# Altium project HIL_RIG_Hardware.PrjPcb (part 5 of 11)

## Sheet  PWM_Output.SchDoc
size A3; SheetNumber: 13; SheetTotal: 29
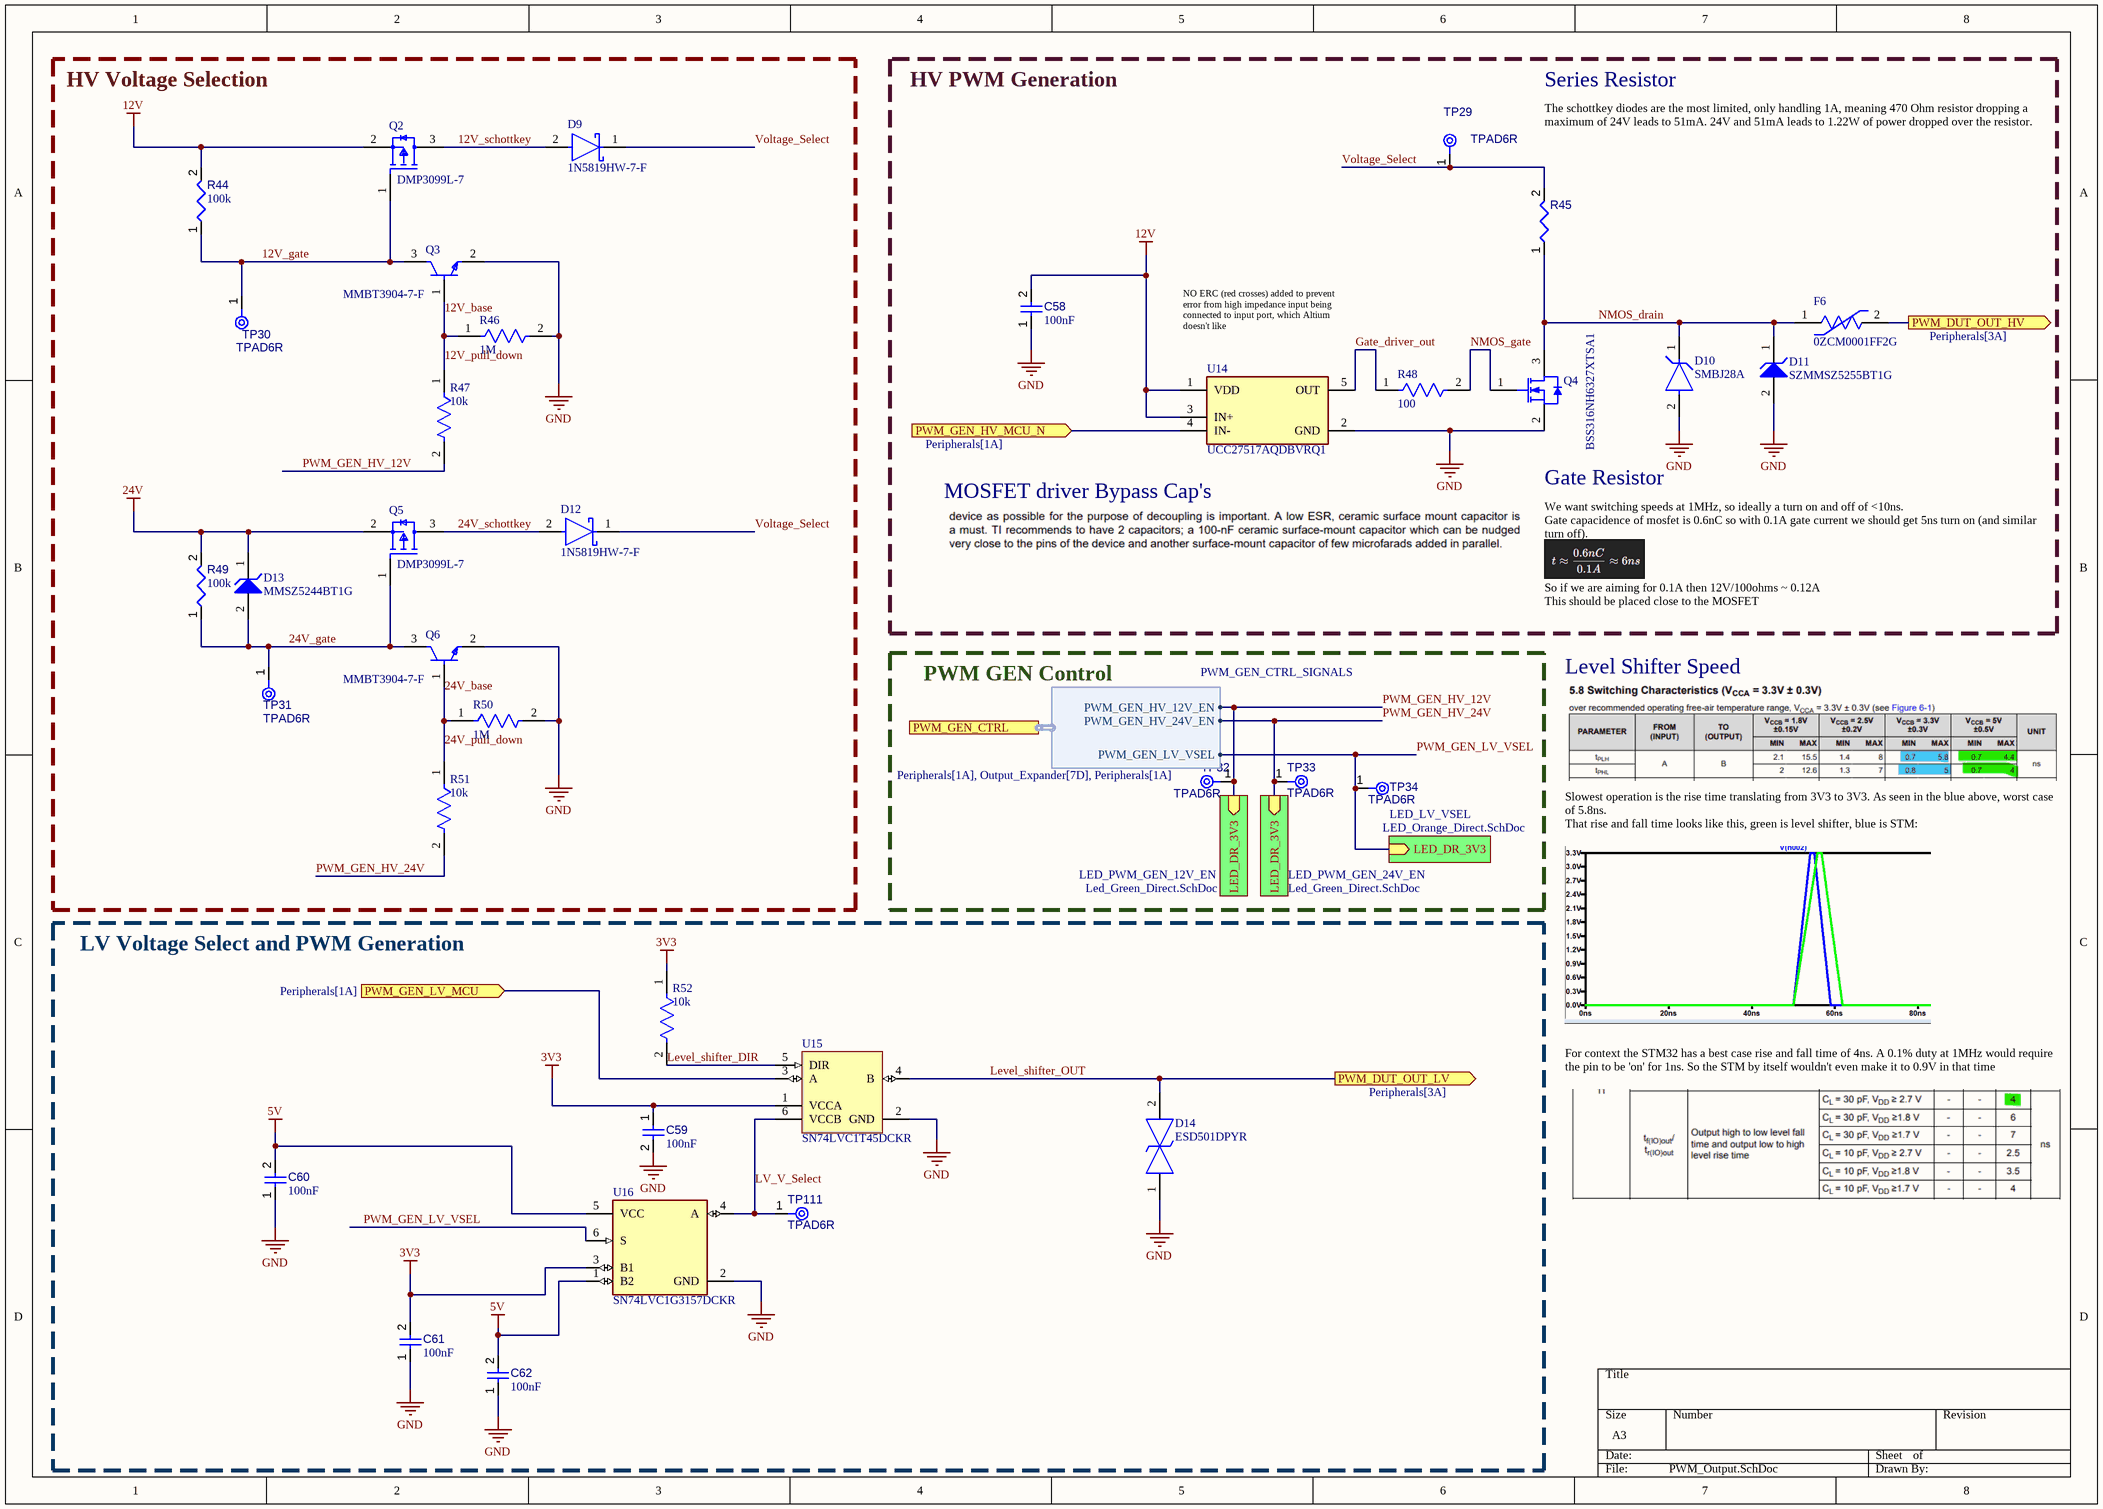
[diagram p9:  PWM_Output.SchDoc]

### Parts
C58  value 100nF  [CAPC1608X90X40NL10T20]  (hidden comment: Capacitor 100 nF +/-10% 50 V 0603)
C59  value 100nF  [CAPC1608X90X40NL10T20]  (hidden comment: Capacitor 100 nF +/-10% 50 V 0603)
C60  value 100nF  [CAPC1608X90X40NL10T20]  (hidden comment: Capacitor 100 nF +/-10% 50 V 0603)
C61  value 100nF  [CAPC1608X90X40NL10T20]  (hidden comment: Capacitor 100 nF +/-10% 50 V 0603)
C62  value 100nF  [CAPC1608X90X40NL10T20]  (hidden comment: Capacitor 100 nF +/-10% 50 V 0603)
D9  1N5819HW-7-F  [FP-SOD123-IPC_C]
D10  SMBJ28A  [FP-SMBJ-MFG]
D11  SZMMSZ5255BT1G  [ONSC-SOD-123-2-425-04_V]
D12  1N5819HW-7-F  [FP-SOD123-IPC_C]
D13  MMSZ5244BT1G  [ONSC-SOD-123-2-425-04_V]
D14  ESD501DPYR  [ESD501DPYR]
F6  0ZCM0001FF2G  [FP-0ZCM0001FF2G-MFG]
Q2  DMP3099L-7  [FP-SOT23-IPC_A]
Q3  MMBT3904-7-F  [FP-SOT23-IPC_A]
Q4  BSS316NH6327XTSA1  [INF-PG-SOT23_L]
Q5  DMP3099L-7  [FP-SOT23-IPC_A]
Q6  MMBT3904-7-F  [FP-SOT23-IPC_A]
R44  value 100k  [FP-AC0603-IPC_C]  (hidden comment: AC0603FR-07100KL)
R45  HOCR2512-2W-470R-5%  [RESC6432X95N]  (value not drawn)
R46  value 1M  [FP-CRGP0603-IPC_C]  (hidden comment: CRGP0603F1M0)
R47  value 10k  [FP-RT0603-IPC_C]  (hidden comment: RT0603BRD0710KL)
R48  value 100  [FP-CRGP2512-IPC_A]  (hidden comment: CRGP2512F100R)
R49  value 100k  [FP-AC0603-IPC_C]  (hidden comment: AC0603FR-07100KL)
R50  value 1M  [FP-CRGP0603-IPC_C]  (hidden comment: CRGP0603F1M0)
R51  value 10k  [FP-RT0603-IPC_C]  (hidden comment: RT0603BRD0710KL)
R52  value 10k  [FP-RT0603-IPC_C]  (hidden comment: RT0603BRD0710KL)
TP29  TPAD6R  [TP06R]  (no BOM)
TP30  TPAD6R  [TP06R]  (no BOM)
TP31  TPAD6R  [TP06R]  (no BOM)
TP32  TPAD6R  [TP06R]  (no BOM)
TP33  TPAD6R  [TP06R]  (no BOM)
TP34  TPAD6R  [TP06R]  (no BOM)
TP111  TPAD6R  [TP06R]  (no BOM)
U14  UCC27517AQDBVRQ1  [FP-DBV0005A-IPC_B]
U15  SN74LVC1T45DCKR  [DCK0006A_M]
U16  SN74LVC1G3157DCKR  [FP-DCK0006A-MFG]

### Blocks framed on the sheet
HV Voltage Selection: D9 D12 D13 Q2 Q3 Q5 Q6 R44 R46 R47 R49-R51 TP30 TP31
PWM GEN Control: TP32-TP34
LV Voltage Select and PWM Generation: C59-C62 D14 R52 TP111 U15 U16

### Sub-sheets
LED_LV_VSEL = LED_Orange_Direct.SchDoc (file not in this document): LED_DR_3V3 (in)
LED_PWM_GEN_12V_EN = Led_Green_Direct.SchDoc (file not in this document): LED_DR_3V3 (in)
LED_PWM_GEN_24V_EN = Led_Green_Direct.SchDoc (file not in this document): LED_DR_3V3 (in)

### Ports
PWM_DUT_OUT_HV (out, see Peripherals[3A]), PWM_DUT_OUT_LV (out, see Peripherals[3A]), PWM_GEN_CTRL (harness PWM_GEN_CTRL_SIGNALS, see Peripherals[1A], Output_Expander[7D], Peripherals[1A]), PWM_GEN_HV_MCU_N (in, see Peripherals[1A]), PWM_GEN_LV_MCU (in, see Peripherals[1A])

### Harnesses
PWM_GEN_CTRL_SIGNALS: PWM_GEN_HV_12V_EN, PWM_GEN_HV_24V_EN, PWM_GEN_LV_VSEL

### Nets
3V3: C59.1 C61.2 R52.1 U15.1(VCCA) U16.3(B1)
5V: C60.2 C62.2 U16.1(B2) U16.5(VCC)
12V: C58.2 Q2.2(S) R44.2 U14.1(VDD) U14.3(IN+)
24V: D13.1(K) Q5.2(S) R49.2
GND: C58.1 C59.2 C60.1 C61.1 C62.1 D10.2(A) D11.2(A) D14.1 Q3.2(E) Q4.2(SOURCE) Q6.2(E) R46.2 R50.2 U14.2(GND) U15.2(GND) U16.2(GND)
12V_base: Q3.1(B) R46.1 R47.1  [also labelled 12V_pull_down]
12V_gate: Q2.1(G) Q3.3(C) R44.1 TP30.1(TP)
12V_schottkey: D9.2(A) Q2.3(D)
24V_base: Q6.1(B) R50.1 R51.1  [also labelled 24V_pull_down]
24V_gate: D13.2(A) Q5.1(G) Q6.3(C) R49.1 TP31.1(TP)
24V_schottkey: D12.2(A) Q5.3(D)
Gate_driver_out: R48.1 U14.5(OUT)
Level_shifter_DIR: R52.2 U15.5(DIR)
Level_shifter_OUT: D14.2 U15.4(B) ; port PWM_DUT_OUT_LV
LV_V_Select: TP111.1(TP) U15.6(VCCB) U16.4(A)
NMOS_drain: D10.1(C) D11.1(K) F6.1 Q4.3(DRAIN) R45.1
NMOS_gate: Q4.1(GATE) R48.2
PWM_GEN_HV_12V: R47.2 TP32.1(TP) ; sheet LED_PWM_GEN_12V_EN/LED_DR_3V3, port PWM_GEN_CTRL.PWM_GEN_HV_12V_EN
PWM_GEN_HV_24V: R51.2 TP33.1(TP) ; sheet LED_PWM_GEN_24V_EN/LED_DR_3V3, port PWM_GEN_CTRL.PWM_GEN_HV_24V_EN
PWM_GEN_LV_VSEL: TP34.1(TP) U16.6(S) ; sheet LED_LV_VSEL/LED_DR_3V3, port PWM_GEN_CTRL.PWM_GEN_LV_VSEL
Voltage_Select: D9.1(C) D12.1(C) R45.2 TP29.1(TP)
NetF6_2: F6.2 ; port PWM_DUT_OUT_HV
NetU14_4: U14.4(IN-) ; port PWM_GEN_HV_MCU_N
NetU15_3: U15.3(A) ; port PWM_GEN_LV_MCU

### Notes on the sheet
- HV PWM Generation
- Series Resistor
- The schottkey diodes are the most limited, only handling 1A, meaning 470 Ohm resistor dropping a maximum of 24V leads to 51mA. 24V and 51mA leads to 1.22W of power dropped over the resistor.
- (near U14) NO ERC (red crosses) added to prevent error from high impedance input being connected to input port, which Altium doesn't like
- (near U14) MOSFET driver Bypass Cap's
- Gate Resistor
- We want switching speeds at 1MHz, so ideally a turn on and off of <10ns.
  Gate capacidence of mosfet is 0.6nC so with 0.1A gate current we should get 5ns turn on (and similar turn off).
  So if we are aiming for 0.1A then 12V/100ohms ~ 0.12A
  This should be placed close to the MOSFET
- Level Shifter Speed
- Slowest operation is the rise time translating from 3V3 to 3V3. As seen in the blue above, worst case of 5.8ns.
  That rise and fall time looks like this, green is level shifter, blue is STM:
  For context the STM32 has a best case rise and fall time of 4ns. A 0.1% duty at 1MHz would require the pin to be 'on' for 1ns. So the STM by itself wouldn't even make it to 0.9V in that time

### Library data of the parts
C58-C62 = CMP-001-00017-6: Chip Capacitor, 100 nF, +/- 10%, 50 V, 0603 (1608 Metric); Voltage Rating: 50V; Capacitor Type: Ceramic; Tolerance: 10%; Mounting Technology: SM; Max Operating Temperature: 125°C; RoHS Compliant: True; Pins: 2; Case/Package: 0603; Min Operating Temperature: -55°C
D9 D12 = CMP-004-00073-1: 1N5819HW Series 40 V 1 A Surface Mount Schottky Barrier Rectifier - SOD-123; Peak Reverse Current: 1mA; Max Junction Temperature (Tj): 125°C; Output Current: 1A; Max Repetitive Reverse Voltage (Vrrm): 40V; Element Configuration: Single; Peak Non-Repetitive Surge Current: 25A; Number of Elements: 1; Forward Voltage: 750mV; Value: 50pF; Max Power Dissipation: 450mW; Polarity: Standard; Case/Package: SOD-123-2; Max Operating Temperature: 125°C; Lead Free: Lead Free; Max Reverse Voltage (DC): 40V; China RoHS: Compliant; RoHS: Compliant; Number of Terminals: 2; REACH SVHC: Yes; Contact Plating: Tin; Pins: 2; Length: 2.85mm; Schedule B: 8541100080, 8541100080; Max Forward Surge Current (Ifsm): 25A; Reverse Standoff Voltage: 40V; Min Operating Temperature: -65°C; Voltage Rating (DC): 40V; Weight: 10.007382mg; Max Output current: 1A; Reverse Voltage: 40V; Current Rating: 1A; Width: 1.7mm; Forward Current: 1A; Lifecycle Status: Production; Packaging: Tape and Reel; Height: 1.45mm; Radiation Hardening: No; Average Rectified Current: 1A; Min Breakdown Voltage: 40V; Termination: SMD/SMT
D10 = CMP-004-00070-1: Tvs Diodes & Esd Suppressors; SMBJ28A; Littelfuse; 28 V; 45.4 V; 31.1 V; 31.1 V; Power Line Protection: No; Clamping Voltage: 45.4V; Number of Channels: 1; Power Rating: 600W; Voltage Rating (DC): 28V; Polarity: Unidirectional; Breakdown Voltage: 32.75V; Element Configuration: Single; Leakage Current: 1µA; Current: 1mA; Max Breakdown Voltage: 34.4V; Forward Voltage: 3.5V; Max Power Dissipation: 5W; Min Breakdown Voltage: 31.1V; Max Junction Temperature (Tj): 150°C; Max Surge Current: 13.3A; Height: 2.61mm; Number of Elements: 1; Power Dissipation: 600W; Case/Package: SMB; Termination: SMD/SMT; Radiation Hardening: No; Mounting Technology: Surface Mount; Lifecycle Status: Production; Direction: Unidirectional; Number of Unidirectional Channels: 1; Reverse Voltage: 28V; Peak Reverse Current: 1µA; Voltage: 28V; Operating Supply Voltage: 28V; Min Operating Temperature: -65°C; Schedule B: 8541100080, 8541100080; REACH SVHC: No; Length: 4.57mm; Packaging: Cut Tape; Country of Origin: Mainland China, Philippines; Test Current: 1mA; Introduction Date: 1996-01-01; Lead Free: Lead Free; Max Operating Temperature: 150°C; Composition: Zener; Pins: 2; Width: 3.94mm; Number of Terminals: 2; Reverse Standoff Voltage: 28V; Harmonized Tariff Schedule (HTS) Code: 8541.10.00.50; RoHS: Compliant; Peak Pulse Power: 600W; Export Control Classification Number (ECCN) Code: EAR99; Max Reverse Leakage Current: 1µA; Reverse Breakdown Voltage: 31.1V; Peak Pulse Current: 13.3A
D11 = CMP-004-00074-1: DIODE ZENER 28V 500MW SOD123 / Zener Diode 28 V 500 mW ±5% Surface Mount SOD-123; Manufacturer Lifecycle Status: ACTIVE; Max Reverse Leakage Current: 100nA; Zener Current: 4.5mA; Polarity: Unidirectional; Number of Elements: 1; Element Configuration: Single; Impedance: 44Ω; Reference Voltage: 28V; Max Operating Temperature: 150°C; Max Power Dissipation: 500mW; Pins: 2; Country of Origin: Mainland China; Packaging: Tape and Reel; Harmonized Tariff Schedule (HTS) Code: 8541.10.00.50; RoHS: Compliant; Lifecycle Status: Production; Introduction Date: 1998-08-19; Composition: Zener; Tolerance: 5%; Lead Free: Lead Free; Number of Terminals: 2; Min Operating Temperature: -55°C; Voltage Tolerance: 5%; REACH SVHC: Yes; Zener Voltage: 28V; China RoHS: Compliant; Export Control Classification Number (ECCN) Code: EAR99; Radiation Hardening: No; Ratings: AEC-Q101; Case/Package: SOD-123-2
D13 = CMP-004-00081-1: MMSZ5244BT1 Series 500 mW 10 mA 14 V SMT Zener Voltage Regulator - SOD-123; Manufacturer Lifecycle Status: ACTIVE; Number of Elements: 1; Zener Voltage: 14V; Impedance: 15Ω; ESD Protection: Yes; Polarity: Unidirectional; Element Configuration: Single; Power Rating: 500mW; Material: Plastic; Voltage Tolerance: 5%; Test Current: 9mA; Max Reverse Leakage Current: 100nA; Forward Voltage: 900mV; RoHS: Compliant; Lifecycle Status: Production; Lead Free: Lead Free; Case/Package: SOD-123-2; Voltage Rating (DC): 14V; Number of Terminals: 2; REACH SVHC: Yes; Height: 1.35mm; Power Dissipation: 500mW; Width: 1.8mm; Length: 2.84mm; Working Voltage: 14V; Max Power Dissipation: 500mW; Pins: 2; Composition: Zener; Zener Current: 9mA; Peak Reverse Current: 100nA; Packaging: Tape and Reel; China RoHS: Compliant; Schedule B: 8541100050, 8541100050; Tolerance: 5%; Min Operating Temperature: -55°C; Max Operating Temperature: 150°C; Contact Plating: Tin; Radiation Hardening: No; Reference Voltage: 14V
D14 = CMP-004-00077-1: ESD Protection Diodes / TVS Diodes 12V bidirectional ul tra-low capacitance; Manufacturer_Name: Texas Instruments; Arrow Part Number: ESD501DPYR; Manufacturer_Part_Number: ESD501DPYR; Height: 0.45mm; Design Item ID: ESD501DPYR; Mouser Price/Stock: https://www.mouser.co.uk/ProductDetail/Texas-Instruments/ESD501DPYR?qs=a2MtRaTmNORm212mp2T0lg%3D%3D; Mouser Part Number: 595-ESD501DPYR; Source: MAX17643ATC+.SchLib; Datasheet Link: https://www.ti.com/lit/ds/symlink/esd501.pdf?ts=1738328273013&ref_url=https%253A%252F%252Fwww.mouser.ph%252; Arrow Price/Stock: https://www.arrow.com/en/products/esd501dpyr/texas-instruments?utm_currency=USD&region=nac
F6 = CMP-005-00023-1: Prices include import duty and tax. RESETTABLE PTC FUSE, SMD, 0603 SIZE, 10MA, 60V;; Trip Current: 30mA; Value: 15Ω; Maximum Resistance 1 Hour (R1max): 100Ω; Ratings: AEC-Q200, TUV; Time to Trip: 1s; Current Rating: 40A; REACH SVHC: Yes; Voltage Rating: 60V; Harmonized Tariff Schedule (HTS) Code: 8533.40.80.70; Mounting Technology: Surface Mount; Length: 1.8mm; Min Operating Temperature: -40°C; Max Operating Temperature: 85°C; Width: 1mm; Export Control Classification Number (ECCN) Code: EAR99; Height: 850µm; Working Voltage: 60V; Case/Package: 0603; RoHS: Compliant; Lifecycle Status: Production; Hold Current: 10mA; Number of Terminals: 2; China RoHS: Compliant; Introduction Date: 2019-09-26
Q2 Q5 = CMP-013-00043-2: DMP3099L Series 30 V 65 mOhm P-Channel Enhancement Mode Mosfet - SOT-23-3; Continuous Drain Current (ID): 3.8A; Max Power Dissipation: 1.08W; Input Capacitance: 563pF; Drain to Source Breakdown Voltage: -30V; Rise Time: 5ns; Drain to Source Resistance: 65mΩ; Min Breakdown Voltage: 30V; Number of Channels: 1; Element Configuration: Single; Max Junction Temperature (Tj): 150°C; Fall Time: 15ns; Threshold Voltage: -2.1V; Turn-Off Delay Time: 31ns; Gate to Source Voltage (Vgs): 20V; Turn-On Delay Time: 4.8ns; Mounting Technology: Surface Mount; Country of Origin: Mainland China; Height: 1.1mm; REACH SVHC: Yes; Export Control Classification Number (ECCN) Code: EAR99; Length: 3mm; Drain to Source Voltage (Vdss): -30V; China RoHS: Compliant; RoHS: Compliant; Min Operating Temperature: -55°C; Number of Terminals: 3; Schedule B: 8541290080, 8541290080; Introduction Date: 2013-05-28; Contact Plating: Tin; Number of Elements: 1; Max Operating Temperature: 150°C; Case/Package: SOT-23; Power Dissipation: 1.08W; Rds On Max: 65mΩ; Ratings: AEC-Q101; Radiation Hardening: No; Weight: 7.994566mg; Width: 1.4mm; Lifecycle Status: Production; Lead Free: Lead Free; Pins: 3
Q3 Q6 = CMP-013-00044-1: Transistor General Purpose BJT NPN 40 Volt 0.2A Automotive 3-Pin SOT-23; Max Junction Temperature (Tj): 150°C; Collector Emitter Saturation Voltage: 300mV; Transition Frequency: 300MHz; Voltage Rating (DC): 40V; Emitter Base Voltage (VEBO): 6V; Max Power Dissipation: 350mW; hFE Min: 30; Continuous Collector Current: 200mA; Collector Base Voltage (VCBO): 60V; Power Dissipation: 310mW; Number of Elements: 1; Element Configuration: Single; Polarity: NPN; Case/Package: SOT-23; Min Operating Temperature: -55°C; RoHS: Compliant; Weight: 7.994566mg; Lifecycle Status: Production; Packaging: Cut Tape; Radiation Hardening: No; Gain Bandwidth Product: 300MHz; China RoHS: Compliant; Pins: 3; Length: 3.05mm; Collector Emitter Voltage (VCEO): 40V; Contact Plating: Tin; Width: 1.4mm; Mounting Technology: Surface Mount; Clock Frequency: 300MHz; Schedule B: 8541210080, 8541210080; Height: 1.1mm; Collector Emitter Breakdown Voltage: 40V; REACH SVHC: Yes; Max Collector Current: 200mA; Number of Terminals: 3; Lead Free: Lead Free; Max Operating Temperature: 150°C; Frequency: 300MHz; Max Breakdown Voltage: 40V
Q4 = CMP-013-00045-1: Power MOSFET, N Channel, 30 V, 1.4 A, 160 mOhm, SOT-23, 3 Pins, Surface Mount; Power Dissipation: 500mW; Number of Channels: 1; Turn-On Delay Time: 3.4ns; Fall Time: 1ns; Max Dual Supply Voltage: 30V; Continuous Drain Current (ID): 1.4A; On-State Resistance: 160mΩ; Turn-Off Delay Time: 5.8ns; Input Capacitance: 71pF; Element Configuration: Single; Gate to Source Voltage (Vgs): 20V; Threshold Voltage: 1.6V; Rise Time: 2.3ns; Pins: 3; Export Control Classification Number (ECCN) Code: EAR99; Max Operating Temperature: 150°C; REACH SVHC: Yes; Width: 1.3mm; Max Power Dissipation: 500mW; Number of Terminals: 3; Number of Elements: 1; Introduction Date: 2011-07-06; Drain to Source Breakdown Voltage: 30V; Country of Origin: Austria, Mainland China, Malaysia; Mounting Technology: Surface Mount; Lead Free: Lead Free; RoHS: Compliant; Min Operating Temperature: -55°C; Min Breakdown Voltage: 30V; Package Quantity: 3000; China RoHS: Compliant; Rds On Max: 160mΩ; Halogen Free: Halogen Free; Schedule B: 8541210080, 8541210080; Drain to Source Voltage (Vdss): 30V; Lifecycle Status: Production; Length: 2.9mm; Height: 1.1mm; Drain to Source Resistance: 160mΩ; Case/Package: SOT-23; Packaging: Tape & Reel
R44 R49 = CMP-009-00345-3: Res Thick Film 0603 100K Ohm 1% 0.1W(1/10W) ±100ppm/C Pad SMD T/R Automotive; Voltage Rating: 75V; Max Power Dissipation: 100mW; Temperature Coefficient: 100ppm/°C; Max Operating Temperature: 155°C; Tolerance: 1%; Case/Package: 0603; Mounting Technology: Surface Mount; Min Operating Temperature: -55°C; Case Code (Imperial): 0603; Case Code (Metric): 1608; China RoHS: Non-Compliant; Composition: Thick Film; Country of Origin: Mainland China, Taiwan; Depth: 800µm; Export Control Classification Number (ECCN) Code: EAR99; Features: Anti-Sulfur, Automotive AEC-Q200, Moisture Resistant; Harmonized Tariff Schedule (HTS) Code: 8533.21.00.30; Height: 450µm; Introduction Date: 2012-04-10; Lead Free: Lead Free; Length: 1.6mm; Lifecycle Status: Production; Military Standard: Not; Number of Terminals: 2; Number of Terminations: 2; Packaging: Tape & Reel; Power Rating: 100mW; Ratings: AEC-Q200; REACH SVHC: Yes; RoHS: Compliant; Schedule B: 8533210045, 8533210045; Termination: SMD/SMT; Width: 800µm; Working Voltage: 75V
R45 = CMP-009-00354-1: 2W Ceramic resistor ±5% 470Ω 2512 Chip Resistor - Surface Mount ROHS
R46 R50 = CMP-009-00317-1: Res Thick Film 0603 1M Ohm 1% 0.25W(1/4W) ±100ppm/C Pad SMD T/R Automotive AEC-Q200; Manufacturer Lifecycle Status: ACTIVE; Operating Supply Voltage: 50V; Power Rating: 250mW; Temperature Coefficient: 100ppm/°C; Lifecycle Status: Production; Schedule B: 8533210045; Max Operating Temperature: 155°C; Case/Package: 0603; China RoHS: Non-Compliant; Packaging: Cut Tape; Voltage Rating (DC): 50V; Mounting Technology: Surface Mount; Voltage Rating: 50V; Harmonized Tariff Schedule (HTS) Code: 8533.21.00.30; Height: 450µm; Composition: Thick Film; Ratings: AEC-Q200; Ambient Temperature Range High: 70°C; Min Operating Temperature: -55°C; Number of Terminals: 2; Length: 1.6mm; Export Control Classification Number (ECCN) Code: EAR99; Introduction Date: 2019-08-27; Working Voltage: 50V; Width: 800µm; RoHS: Compliant; Tolerance: 1%; REACH SVHC: Yes
R47 R51 R52 = CMP-009-00322-1: Res Thin Film 0603 10K Ohm 0.1% 1/10W |25ppm/|C SMD Paper T/R; Voltage Rating: 75V; Max Power Dissipation: 100mW; Temperature Coefficient: 25ppm/°C; Min Operating Temperature: -55°C; Case/Package: 0603; Mounting Technology: Surface Mount; Max Operating Temperature: 155°C; Tolerance: 0.1%; Case Code (Imperial): 0603; China RoHS: Non-Compliant; Composition: Thin Film; Country of Origin: Mainland China, Taiwan; Depth: 800µm; Export Control Classification Number (ECCN) Code: EAR99; Features: Moisture Resistant; Harmonized Tariff Schedule (HTS) Code: 8533.21.00.30; Height: 450µm; Introduction Date: 2008-06-09; Lead Free: Lead Free; Length: 1.6mm; Lifecycle Status: Production; Military Standard: Not; Number of Terminals: 2; Number of Terminations: 2; Power Rating: 100mW; REACH SVHC: Yes; RoHS: Compliant; Schedule B: 8533210045, 8533210045; Termination: SMD/SMT; Voltage Rating (DC): 75V; Weight: 2.012816mg; Width: 800µm; Working Voltage: 75V
R48 = CMP-009-00342-1: 2W Thick Film Resistors ±1% ±200ppm/℃ 100Ω 2512 Chip Resistor - Surface Mount ROHS; Manufacturer Lifecycle Status: ACTIVE; Operating Supply Voltage: 500V; Temperature Coefficient: 100ppm/°C; Ratings: AEC-Q200; Working Voltage: 500V; Lifecycle Status: Production; Voltage Rating (DC): 500V; Number of Terminals: 2; RoHS: Compliant; Voltage Rating: 500V; Case/Package: 2512; Mounting Technology: Surface Mount; Max Operating Temperature: 155°C; Ambient Temperature Range High: 70°C; Composition: Thick Film; Tolerance: 1%; Height: 550µm; Length: 6.35mm; Packaging: Cut Tape; Min Operating Temperature: -55°C; Width: 3.2mm; China RoHS: Non-Compliant; REACH SVHC: Yes; Power Rating: 2W; Schedule B: 8533210025, 8533210025
TP29-TP34 TP111 = CMP-00028-00002-2: 0.6mm round; Pins: 1
U14 = CMP-00024-00007-1: Automotive 4-A/4-A single-channel gate driver with 5-V UVLO and dual-input structure 5-SOT-23 -40 to 125; Manufacturer Lifecycle Status: ACTIVE; Rise Time: 8ns; Max Junction Temperature (Tj): 150°C; Output Current: 4A; Propagation Delay: 13ns; Number of Outputs: 1; Min Supply Voltage: 4.5V; Fall Time: 7ns; Max Supply Voltage: 18V; Channel Type: Single; Mounting Technology: Surface Mount; Max Output current: 4A; Ambient Temperature Range High: 140°C; Schedule B: 8542390000, 8542390000; Packaging: Tape & Reel (TR); Radiation Hardening: No; Height: 1.45mm; Pins: 5; Case/Package: SOT-23; Lifecycle Status: Production; Length: 2.9mm; Number of Drivers: 1; Thickness: 1.2mm; Lead Free: Lead Free; Number of Channels: 1; RoHS: Compliant; Min Operating Temperature: -40°C; Max Operating Temperature: 125°C; Width: 1.6mm
U15 = CMP-016-00013-1: Translators, Level Shifters bidirectional 420Mbps 1.65V~5.5VCCA 1.65V~5.5VCCB; Manufacturer Lifecycle Status: ACTIVE; Min Supply Voltage: 1.65V; Number of Elements: 1; Quiescent Current: 3µA; Logic Function: Transceiver, Translator; Propagation Delay: 3.9ns; Low Level Output Current: 32mA; Topology: Push-Pull; Turn-On Delay Time: 17.7ns; Polarity: Non-Inverting; High Level Output Current: -32mA; Max Supply Voltage: 5.5V; Lead Free: Lead Free; Min Operating Temperature: -40°C; Radiation Hardening: No; Lifecycle Status: Production; Mounting Technology: Surface Mount; RoHS: Compliant; Length: 2mm; Direction: Bidirectional; Packaging: Cut Tape; Pins: 6; Width: 1.25mm; Case/Package: SC; Data Rate: 420Mbps; Schedule B: 8542390000, 8542390000; Min Supply Voltage (DC): 1.65V; Height: 1.1mm; Max Operating Temperature: 85°C; Number of Channels: 1; Thickness: 900µm; Weight: 2.494758mg; Number of Bits: 1; Contact Plating: Gold; REACH SVHC: No
U16 = CMP-011-00020-2: Single-pole Double-throw Analog Switch SPDT, 1 Func, 1 Channel, Cmos, PDSO6; Manufacturer Lifecycle Status: ACTIVE; Number of Circuits: 1; Drain to Source Resistance: 11Ω; High Level Output Current: 128mA; Number of Inputs: 2; Min Supply Voltage: 1.65V; Max Supply Current: 10µA; Polarity: Non-Inverting; -3db Bandwidth: 340MHz; Nominal Supply Current: 1µA; Bandwidth: 300MHz; Interface: I2C, SPI, UART; Propagation Delay: 2ns; Max Junction Temperature (Tj): 150°C; Supply Type: Single; Turn-On Delay Time: 5.7ns; Value: 15Ω; On-State Resistance: 6Ω; Max Supply Voltage: 5.5V; Turn-Off Delay Time: 3.8ns; Lifecycle Status: Production; Min Operating Temperature: -40°C; Width: 1.25mm; RoHS: Compliant; Packaging: Cut Tape; Radiation Hardening: No; Number of Channels: 1; Height: 1.1mm; Termination: SMD/SMT; Length: 2mm; Low Level Output Current: 128mA; Case/Package: SC; Operating Supply Current: 1µA; Number of Outputs: 1; Schedule B: 8542390000, 8542390000; Max Operating Temperature: 125°C; Number of Bits: 1; Pins: 6; Weight: 2.494758mg; Frequency: 340MHz; Throw Configuration: SPDT; Mounting Technology: Surface Mount; Contact Plating: Gold; Ambient Temperature Range High: 125°C; Lead Free: Lead Free; REACH SVHC: No; Thickness: 900µm

## Sheet  Analogue_Input.SchDoc
size A4; SheetNumber: 14; SheetTotal: 29
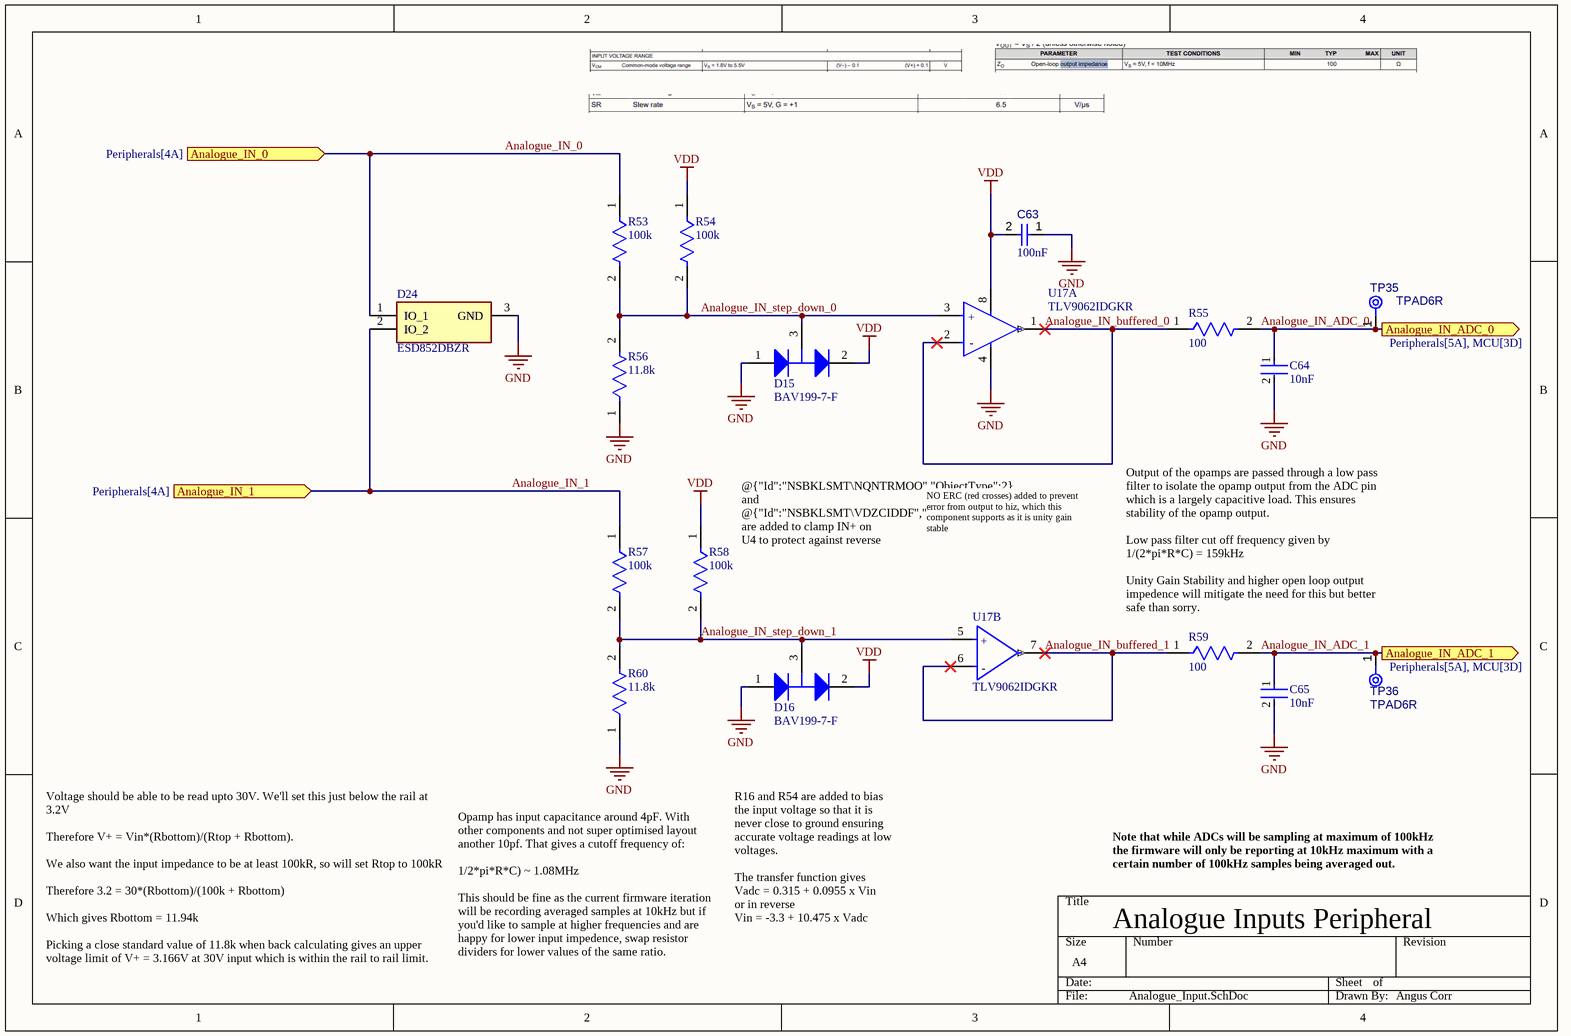
[diagram p10:  Analogue_Input.SchDoc]

### Parts
C63  value 100nF  [CAPC1608X90X40NL10T20]  (hidden comment: Capacitor 100 nF +/-10% 50 V 0603)
C64  value 10nF  [FP-CC0603-DA-IPC_B]  (hidden comment: CC0603KRX7R9BB103)
C65  value 10nF  [FP-CC0603-DA-IPC_B]  (hidden comment: CC0603KRX7R9BB103)
D15  BAV199-7-F  [DIOD-SOT23-3_A_V]
D16  BAV199-7-F  [DIOD-SOT23-3_A_V]
D24  ESD852DBZR  [SOT95P237X112-3N]
R53  value 100k  [FP-RT0603-IPC_C]  (hidden comment: RT0603BRE07100KL)
R54  value 100k  [FP-RT0603-IPC_C]  (hidden comment: RT0603BRE07100KL)
R55  value 100  [FP-RT0603-IPC_C]  (hidden comment: RT0603BRD07100RL)
R56  value 11.8k  [FP-RT0603-IPC_A]  (hidden comment: RT0603BRD0711K8L)
R57  value 100k  [FP-RT0603-IPC_C]  (hidden comment: RT0603BRE07100KL)
R58  value 100k  [FP-RT0603-IPC_C]  (hidden comment: RT0603BRE07100KL)
R59  value 100  [FP-RT0603-IPC_C]  (hidden comment: RT0603BRD07100RL)
R60  value 11.8k  [FP-RT0603-IPC_A]  (hidden comment: RT0603BRD0711K8L)
TP35  TPAD6R  [TP06R]  (no BOM)
TP36  TPAD6R  [TP06R]  (no BOM)
U17  TLV9062IDGKR  [FP-DGK0008A-IPC_A]  (parts A,B of 2)

### Ports
Analogue_IN_0 (in, see Peripherals[4A]), Analogue_IN_1 (in, see Peripherals[4A]), Analogue_IN_ADC_0 (out, see Peripherals[5A], MCU[3D]), Analogue_IN_ADC_1 (out, see Peripherals[5A], MCU[3D])

### Nets
GND: C63.1 C64.2 C65.2 D15.1(A) D16.1(A) D24.3(GND) R56.1 R60.1 U17.4(V-)
VDD: C63.2 D15.2(K) D16.2(K) R54.1 R58.1 U17.8(V+)
Analogue_IN_0: D24.1(IO_1) R53.1 ; port Analogue_IN_0
Analogue_IN_1: D24.2(IO_2) R57.1 ; port Analogue_IN_1
Analogue_IN_ADC_0: C64.1 R55.2 TP35.1(TP) ; port Analogue_IN_ADC_0
Analogue_IN_ADC_1: C65.1 R59.2 TP36.1(TP) ; port Analogue_IN_ADC_1
Analogue_IN_buffered_0: R55.1 U17.1(OUT1) U17.2(IN1-)
Analogue_IN_buffered_1: R59.1 U17.6(IN2-) U17.7(OUT2)
Analogue_IN_step_down_0: D15.3(C) R53.2 R54.2 R56.2 U17.3(IN1+)
Analogue_IN_step_down_1: D16.3(C) R57.2 R58.2 R60.2 U17.5(IN2+)

### Notes on the sheet
- (near R58) @{"Id":"NSBKLSMT\NQNTRMOO","ObjectType":2} and @{"Id":"NSBKLSMT\VDZCIDDF","ObjectType":2} are added to clamp IN+ on U4 to protect against reverse bias and overvoltage.
- NO ERC (red crosses) added to prevent error from output to hiz, which this component supports as it is unity gain stable
- Output of the opamps are passed through a low pass filter to isolate the opamp output from the ADC pin which is a largely capacitive load. This ensures stability of the opamp output.
  Low pass filter cut off frequency given by 1/(2*pi*R*C) = 159kHz
  Unity Gain Stability and higher open loop output impedence will mitigate the need for this but better safe than sorry.
- Note that while ADCs will be sampling at maximum of 100kHz the firmware will only be reporting at 10kHz maximum with a certain number of 100kHz samples being averaged out.
- Voltage should be able to be read upto 30V. We'll set this just below the rail at 3.2V
  Therefore V+ = Vin*(Rbottom)/(Rtop + Rbottom).
  We also want the input impedance to be at least 100kR, so will set Rtop to 100kR
  Therefore 3.2 = 30*(Rbottom)/(100k + Rbottom)
  Which gives Rbottom = 11.94k
  Picking a close standard value of 11.8k when back calculating gives an upper voltage limit of V+ = 3.166V at 30V input which is within the rail to rail limit.
- Opamp has input capacitance around 4pF. With other components and not super optimised layout another 10pf. That gives a cutoff frequency of:
  1/2*pi*R*C) ~ 1.08MHz
  This should be fine as the current firmware iteration will be recording averaged samples at 10kHz but if you'd like to sample at higher frequencies and are happy for lower input impedence, swap resistor dividers for lower values of the same ratio.
- R16 and R54 are added to bias the input voltage so that it is never close to ground ensuring accurate voltage readings at low voltages.
  The transfer function gives
  Vadc = 0.315 + 0.0955 x Vin
  or in reverse
  Vin = -3.3 + 10.475 x Vadc
- Analogue Inputs Peripheral
- Angus Corr

### Library data of the parts
C63 = CMP-001-00017-6: as C58-C62 on sheet  PWM_Output; Tolerance: 10%; Mounting Technology: SM; Max Operating Temperature: 125°C; RoHS Compliant: True; Pins: 2; Case/Package: 0603; Min Operating Temperature: -55°C
C64 C65 = CMP-001-00138-1: 50V 10nF X7R ±10% 0603 Multilayer Ceramic Capacitors MLCC - SMD/SMT ROHS; Insulation Resistance: 100GΩ; Thickness: 889µm; China RoHS: Compliant; Export Control Classification Number (ECCN) Code: EAR99; Termination: SMD/SMT; Radiation Hardening: No; Voltage Rating: 50V; Depth: 800µm; Number of Terminals: 2; Max Operating Temperature: 125°C; Dielectric Material: Ceramic; Voltage Rating (DC): 50V; Dielectric: X7R; Composition: Ceramic; Mounting Technology: Surface Mount; Halogen Free: Halogen Free; Width: 800µm; Case Code (Metric): 1608; Min Operating Temperature: -55°C; Height: 800µm; Schedule B: 8532240020, 8532240020; Introduction Date: 2003-01-27; RoHS: Compliant; Length: 1.6mm; Voltage: 50V; Tolerance: 10%; Lifecycle Status: Production; Case/Package: 0603; Lead Free: Lead Free; Material: Ceramic; Country of Origin: Mainland China, Taiwan; Harmonized Tariff Schedule (HTS) Code: 8532.24.00.20; Case Code (Imperial): 0603; Pins: 2; REACH SVHC: Yes
D15 D16 = CMP-004-00056-1: Diode Standard Recovery Rectifier 85 Volt 0.16A 3-Pin SOT-23 Tape and Reel; Max Surge Current: 4A; Forward Current: 150mA; Forward Voltage: 900mV; Pins: 3; Case/Package: SOT-23; Max Operating Temperature: 150°C; Mounting Technology: Surface Mount; Min Operating Temperature: -65°C
D24 = CMP-031-00025-1: 61V (Typ) Clamp 4.3A (8/20s) Ipp Tvs Diode Surface Mount SOT-23-3; Manufacturer_Name: Texas Instruments; Datasheet Link: https://www.ti.com/lit/ds/symlink/esd852.pdf?ts=1728759309679&ref_url=https%253A%252F%252Fwww.mouser.com%252F; Arrow Price/Stock: https://www.arrow.com/en/products/esd852dbzr/texas-instruments?utm_currency=USD&region=nac; Height: 1.12mm; Mouser Price/Stock: https://www.mouser.co.uk/ProductDetail/Texas-Instruments/ESD852DBZR?qs=Z%252BL2brAPG1KJL96MCdc2ZA%3D%3D; Manufacturer_Part_Number: ESD852DBZR; Arrow Part Number: ESD852DBZR; Design Item ID: ESD852DBZR; Source: MAX17643ATC+.SchLib; Mouser Part Number: 595-ESD852DBZR
R53 R54 R57 R58 = CMP-009-00343-1: 100mW Thin Film Resistor 75V ±50ppm/℃ ±0.1% 100kΩ 0603 Chip Resistor - Surface Mount ROHS; Temperature Coefficient: 50ppm/°C; Voltage Rating (DC): 50V; Lead Free: Lead Free; Tolerance: 0.1%; Contact Plating: Tin; Schedule B: 8533210045, 8533210045; Composition: Thin Film; Features: Moisture Resistant; Case Code (Imperial): 0603; Depth: 800µm; Power Rating: 100mW; Case/Package: 0603; Number of Terminations: 2; REACH SVHC: Yes; Mounting Technology: Surface Mount; Working Voltage: 75V; RoHS: Compliant; Lifecycle Status: Production; Voltage Rating: 75V; Length: 1.6mm; Min Operating Temperature: -55°C; Military Standard: Not; Height: 450µm; Max Operating Temperature: 155°C; Max Power Dissipation: 100mW; Number of Terminals: 2; Radiation Hardening: No; Width: 800µm; China RoHS: Non-Compliant; Packaging: Tape & Reel (TR)
R55 R59 = CMP-009-00335-1: 100mW Thin Film Resistor 75V ±25ppm/℃ ±0.1% 100Ω 0603 Chip Resistor - Surface Mount ROHS; Temperature Coefficient: 25ppm/°C; Height: 450µm; Min Operating Temperature: -55°C; China RoHS: Non-Compliant; Power Rating: 100mW; Composition: Thin Film; Number of Terminals: 2; REACH SVHC: Yes; Tolerance: 0.1%; Length: 1.6mm; Mounting Technology: Surface Mount; Working Voltage: 75V; Lifecycle Status: Production; Voltage Rating: 75V; RoHS: Compliant; Width: 800µm; Max Operating Temperature: 155°C; Case/Package: 0603; Case Code (Imperial): 0603; Country of Origin: Mainland China, Taiwan; Depth: 800µm; Export Control Classification Number (ECCN) Code: EAR99; Features: Moisture Resistant; Harmonized Tariff Schedule (HTS) Code: 8533.21.00.30; Introduction Date: 2008-06-09; Lead Free: Lead Free; Max Power Dissipation: 100mW; Military Standard: Not; Number of Terminations: 2; Schedule B: 8533210045, 8533210045; Termination: SMD/SMT; Voltage Rating (DC): 75V; Weight: 2.012816mg
R56 R60 = CMP-009-00255-1: 100mW Thin Film Resistor ±25ppm/℃ ±0.1% 11.8kΩ 0603 Chip Resistor - Surface Mount ROHS; Voltage Rating: 75V; Min Operating Temperature: -55°C; Case/Package: 0603; Max Operating Temperature: 155°C; Tolerance: 0.1%; Mounting Technology: Surface Mount
TP35 TP36 = CMP-00028-00002-2: 0.6mm round; Pins: 1
U17 = CMP-014-00005-1: Dual, 5.5-V, 10-MHz operational amplifier 8-VSSOP -40 to 125; Min Supply Voltage: 1.8V; Max Supply Voltage: 5.5V; Pins: 8; Max Operating Temperature: 125°C; Case/Package: VSSOP; Min Operating Temperature: -40°C